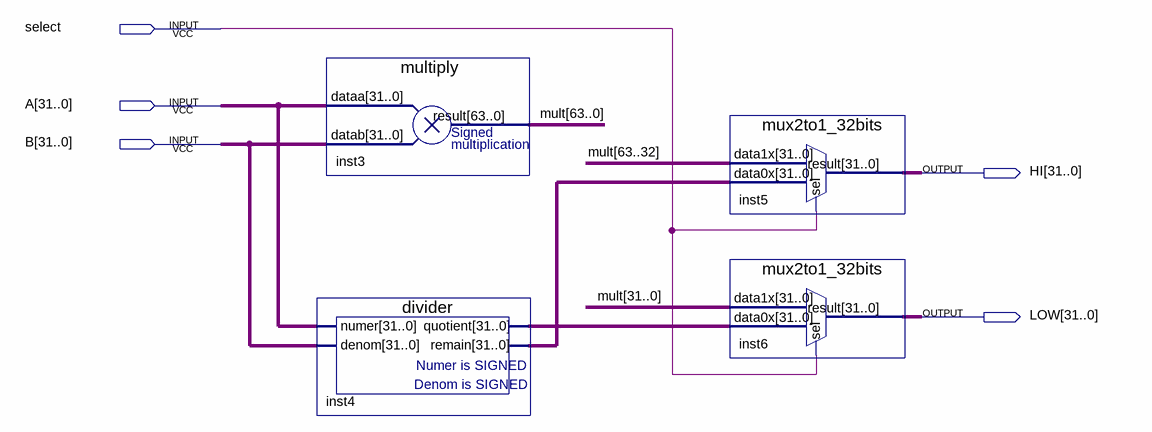
[diagram p0: schematic sheet]
// Quartus schematic test.bdf as structural Verilog: 4 symbols, 5 pins
module test (
  input  select,
  input  [31:0] A,
  input  [31:0] B,
  output [31:0] HI,
  output [31:0] LOW
);

  wire [31:0] inst4_quotient, inst4_remain;
  wire [63:0] mult;

  multiply inst3 (.dataa(A), .datab(B), .result(mult));
  divider inst4 (.numer(A), .denom(B), .quotient(inst4_quotient), .remain(inst4_remain));
  mux2to1_32bits inst5 (.data1x(mult[63:32]), .data0x(inst4_remain), .sel(select), .result(HI));
  mux2to1_32bits inst6 (.data1x(mult[31:0]), .data0x(inst4_quotient), .sel(select), .result(LOW));
endmodule
